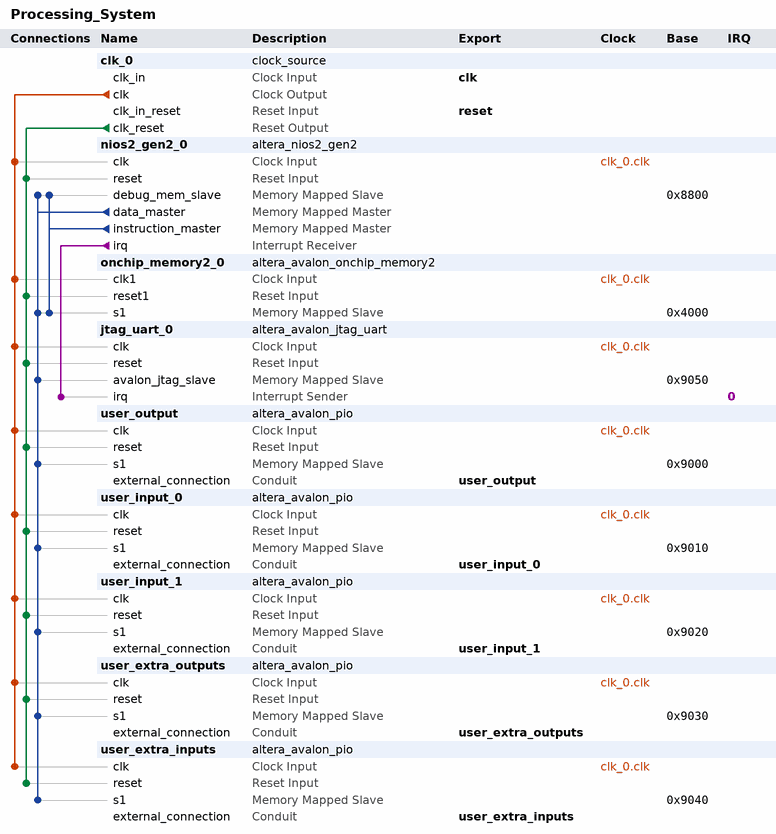
[diagram p0: system contents]
# Platform Designer (Qsys) system Processing_System, MAX 10 10M25SAE144C8G
# Parameters at their usual value, and those the tool derives, are not listed.
package require -exact qsys 18.1
create_system Processing_System
set_project_property DEVICE_FAMILY {MAX 10}
set_project_property DEVICE 10M25SAE144C8G

add_instance clk_0 clock_source 18.1
set_instance_parameter_value clk_0 clockFrequency 50000000

add_instance nios2_gen2_0 altera_nios2_gen2 18.1
set_instance_parameter_value nios2_gen2_0 dcache_size 2048
set_instance_parameter_value nios2_gen2_0 exceptionSlave onchip_memory2_0.s1
set_instance_parameter_value nios2_gen2_0 icache_size 4096
set_instance_parameter_value nios2_gen2_0 impl Tiny
set_instance_parameter_value nios2_gen2_0 resetSlave onchip_memory2_0.s1

add_instance onchip_memory2_0 altera_avalon_onchip_memory2 18.1
set_instance_parameter_value onchip_memory2_0 dataWidth 32
set_instance_parameter_value onchip_memory2_0 dualPort false
set_instance_parameter_value onchip_memory2_0 initMemContent true
set_instance_parameter_value onchip_memory2_0 initializationFileName onchip_mem.hex
set_instance_parameter_value onchip_memory2_0 memorySize 16384

add_instance jtag_uart_0 altera_avalon_jtag_uart 18.1
set_instance_parameter_value jtag_uart_0 simInteractiveOptions NO_INTERACTIVE_WINDOWS

add_instance user_output altera_avalon_pio 18.1
set_instance_parameter_value user_output direction Input
set_instance_parameter_value user_output width 32

add_instance user_input_0 altera_avalon_pio 18.1
set_instance_parameter_value user_input_0 direction Output
set_instance_parameter_value user_input_0 width 32

add_instance user_input_1 altera_avalon_pio 18.1
set_instance_parameter_value user_input_1 direction Output
set_instance_parameter_value user_input_1 width 32

add_instance user_extra_outputs altera_avalon_pio 18.1
set_instance_parameter_value user_extra_outputs direction Input
set_instance_parameter_value user_extra_outputs width 4

add_instance user_extra_inputs altera_avalon_pio 18.1
set_instance_parameter_value user_extra_inputs direction Output
set_instance_parameter_value user_extra_inputs width 4

# connections
add_connection clk_0.clk jtag_uart_0.clk clock
add_connection clk_0.clk nios2_gen2_0.clk clock
add_connection clk_0.clk onchip_memory2_0.clk1 clock
add_connection clk_0.clk user_extra_inputs.clk clock
add_connection clk_0.clk user_extra_outputs.clk clock
add_connection clk_0.clk user_input_0.clk clock
add_connection clk_0.clk user_input_1.clk clock
add_connection clk_0.clk user_output.clk clock
add_connection clk_0.clk_reset jtag_uart_0.reset reset
add_connection clk_0.clk_reset nios2_gen2_0.reset reset
add_connection clk_0.clk_reset onchip_memory2_0.reset1 reset
add_connection clk_0.clk_reset user_extra_inputs.reset reset
add_connection clk_0.clk_reset user_extra_outputs.reset reset
add_connection clk_0.clk_reset user_input_0.reset reset
add_connection clk_0.clk_reset user_input_1.reset reset
add_connection clk_0.clk_reset user_output.reset reset
add_connection nios2_gen2_0.data_master jtag_uart_0.avalon_jtag_slave avalon
set_connection_parameter_value nios2_gen2_0.data_master/jtag_uart_0.avalon_jtag_slave baseAddress 0x9050
add_connection nios2_gen2_0.data_master nios2_gen2_0.debug_mem_slave avalon
set_connection_parameter_value nios2_gen2_0.data_master/nios2_gen2_0.debug_mem_slave baseAddress 0x8800
add_connection nios2_gen2_0.data_master onchip_memory2_0.s1 avalon
set_connection_parameter_value nios2_gen2_0.data_master/onchip_memory2_0.s1 baseAddress 0x4000
add_connection nios2_gen2_0.data_master user_extra_inputs.s1 avalon
set_connection_parameter_value nios2_gen2_0.data_master/user_extra_inputs.s1 baseAddress 0x9040
add_connection nios2_gen2_0.data_master user_extra_outputs.s1 avalon
set_connection_parameter_value nios2_gen2_0.data_master/user_extra_outputs.s1 baseAddress 0x9030
add_connection nios2_gen2_0.data_master user_input_0.s1 avalon
set_connection_parameter_value nios2_gen2_0.data_master/user_input_0.s1 baseAddress 0x9010
add_connection nios2_gen2_0.data_master user_input_1.s1 avalon
set_connection_parameter_value nios2_gen2_0.data_master/user_input_1.s1 baseAddress 0x9020
add_connection nios2_gen2_0.data_master user_output.s1 avalon
set_connection_parameter_value nios2_gen2_0.data_master/user_output.s1 baseAddress 0x9000
add_connection nios2_gen2_0.instruction_master nios2_gen2_0.debug_mem_slave avalon
set_connection_parameter_value nios2_gen2_0.instruction_master/nios2_gen2_0.debug_mem_slave baseAddress 0x8800
add_connection nios2_gen2_0.instruction_master onchip_memory2_0.s1 avalon
set_connection_parameter_value nios2_gen2_0.instruction_master/onchip_memory2_0.s1 baseAddress 0x4000
add_connection nios2_gen2_0.irq jtag_uart_0.irq interrupt
set_connection_parameter_value nios2_gen2_0.irq/jtag_uart_0.irq irqNumber 0

# exported interfaces
add_interface clk clock sink
set_interface_property clk EXPORT_OF clk_0.clk_in
add_interface reset reset sink
set_interface_property reset EXPORT_OF clk_0.clk_in_reset
add_interface user_extra_inputs conduit end
set_interface_property user_extra_inputs EXPORT_OF user_extra_inputs.external_connection
add_interface user_extra_outputs conduit end
set_interface_property user_extra_outputs EXPORT_OF user_extra_outputs.external_connection
add_interface user_input_0 conduit end
set_interface_property user_input_0 EXPORT_OF user_input_0.external_connection
add_interface user_input_1 conduit end
set_interface_property user_input_1 EXPORT_OF user_input_1.external_connection
add_interface user_output conduit end
set_interface_property user_output EXPORT_OF user_output.external_connection

set_interconnect_requirement {$system} qsys_mm.clockCrossingAdapter HANDSHAKE
set_interconnect_requirement {$system} qsys_mm.enableEccProtection FALSE
set_interconnect_requirement {$system} qsys_mm.insertDefaultSlave FALSE
set_interconnect_requirement {$system} qsys_mm.maxAdditionalLatency 1

save_system Processing_System.qsys
